# EAGLE design piezo-layer_v0.95-R004 (EAGLE 6.5.0)
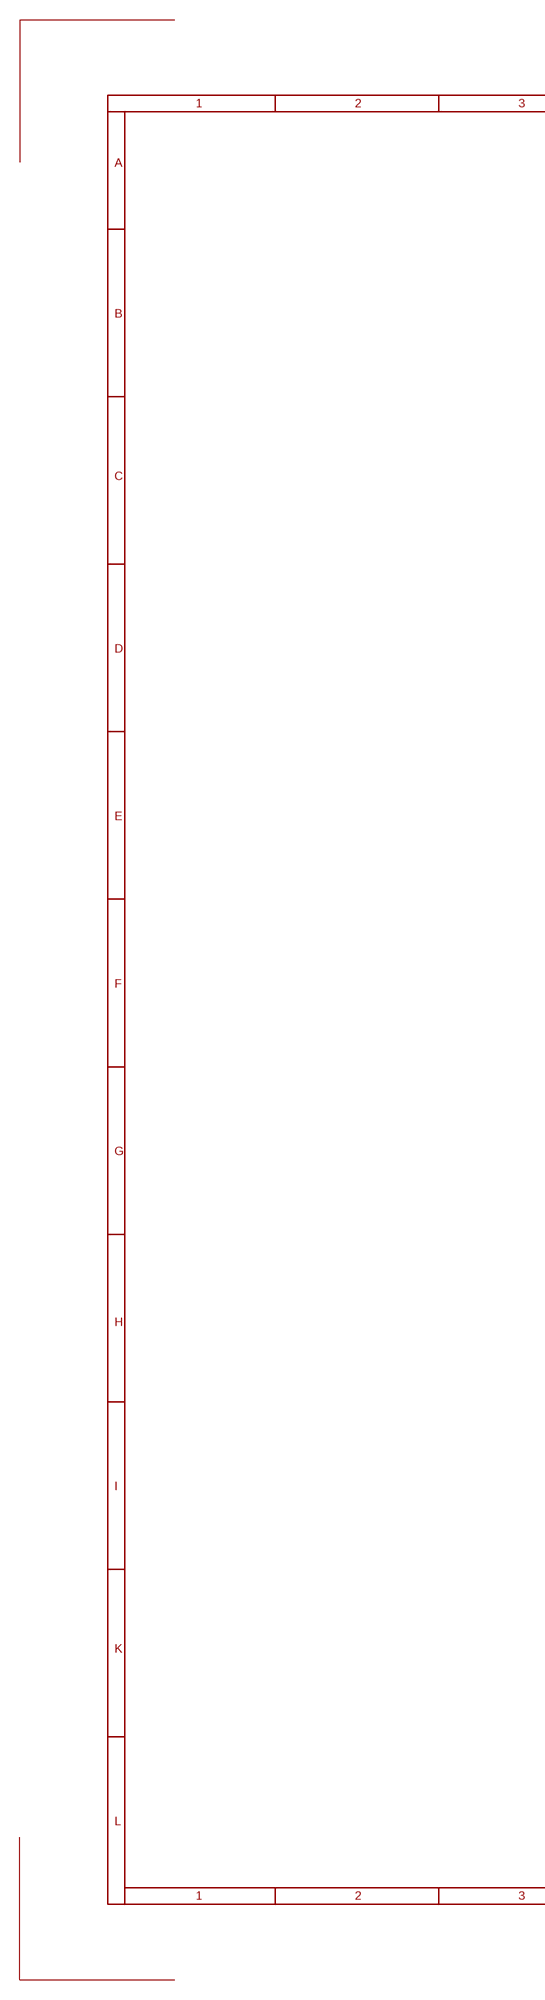
[diagram p0: schematic, sheet 1, part 1 of 2]
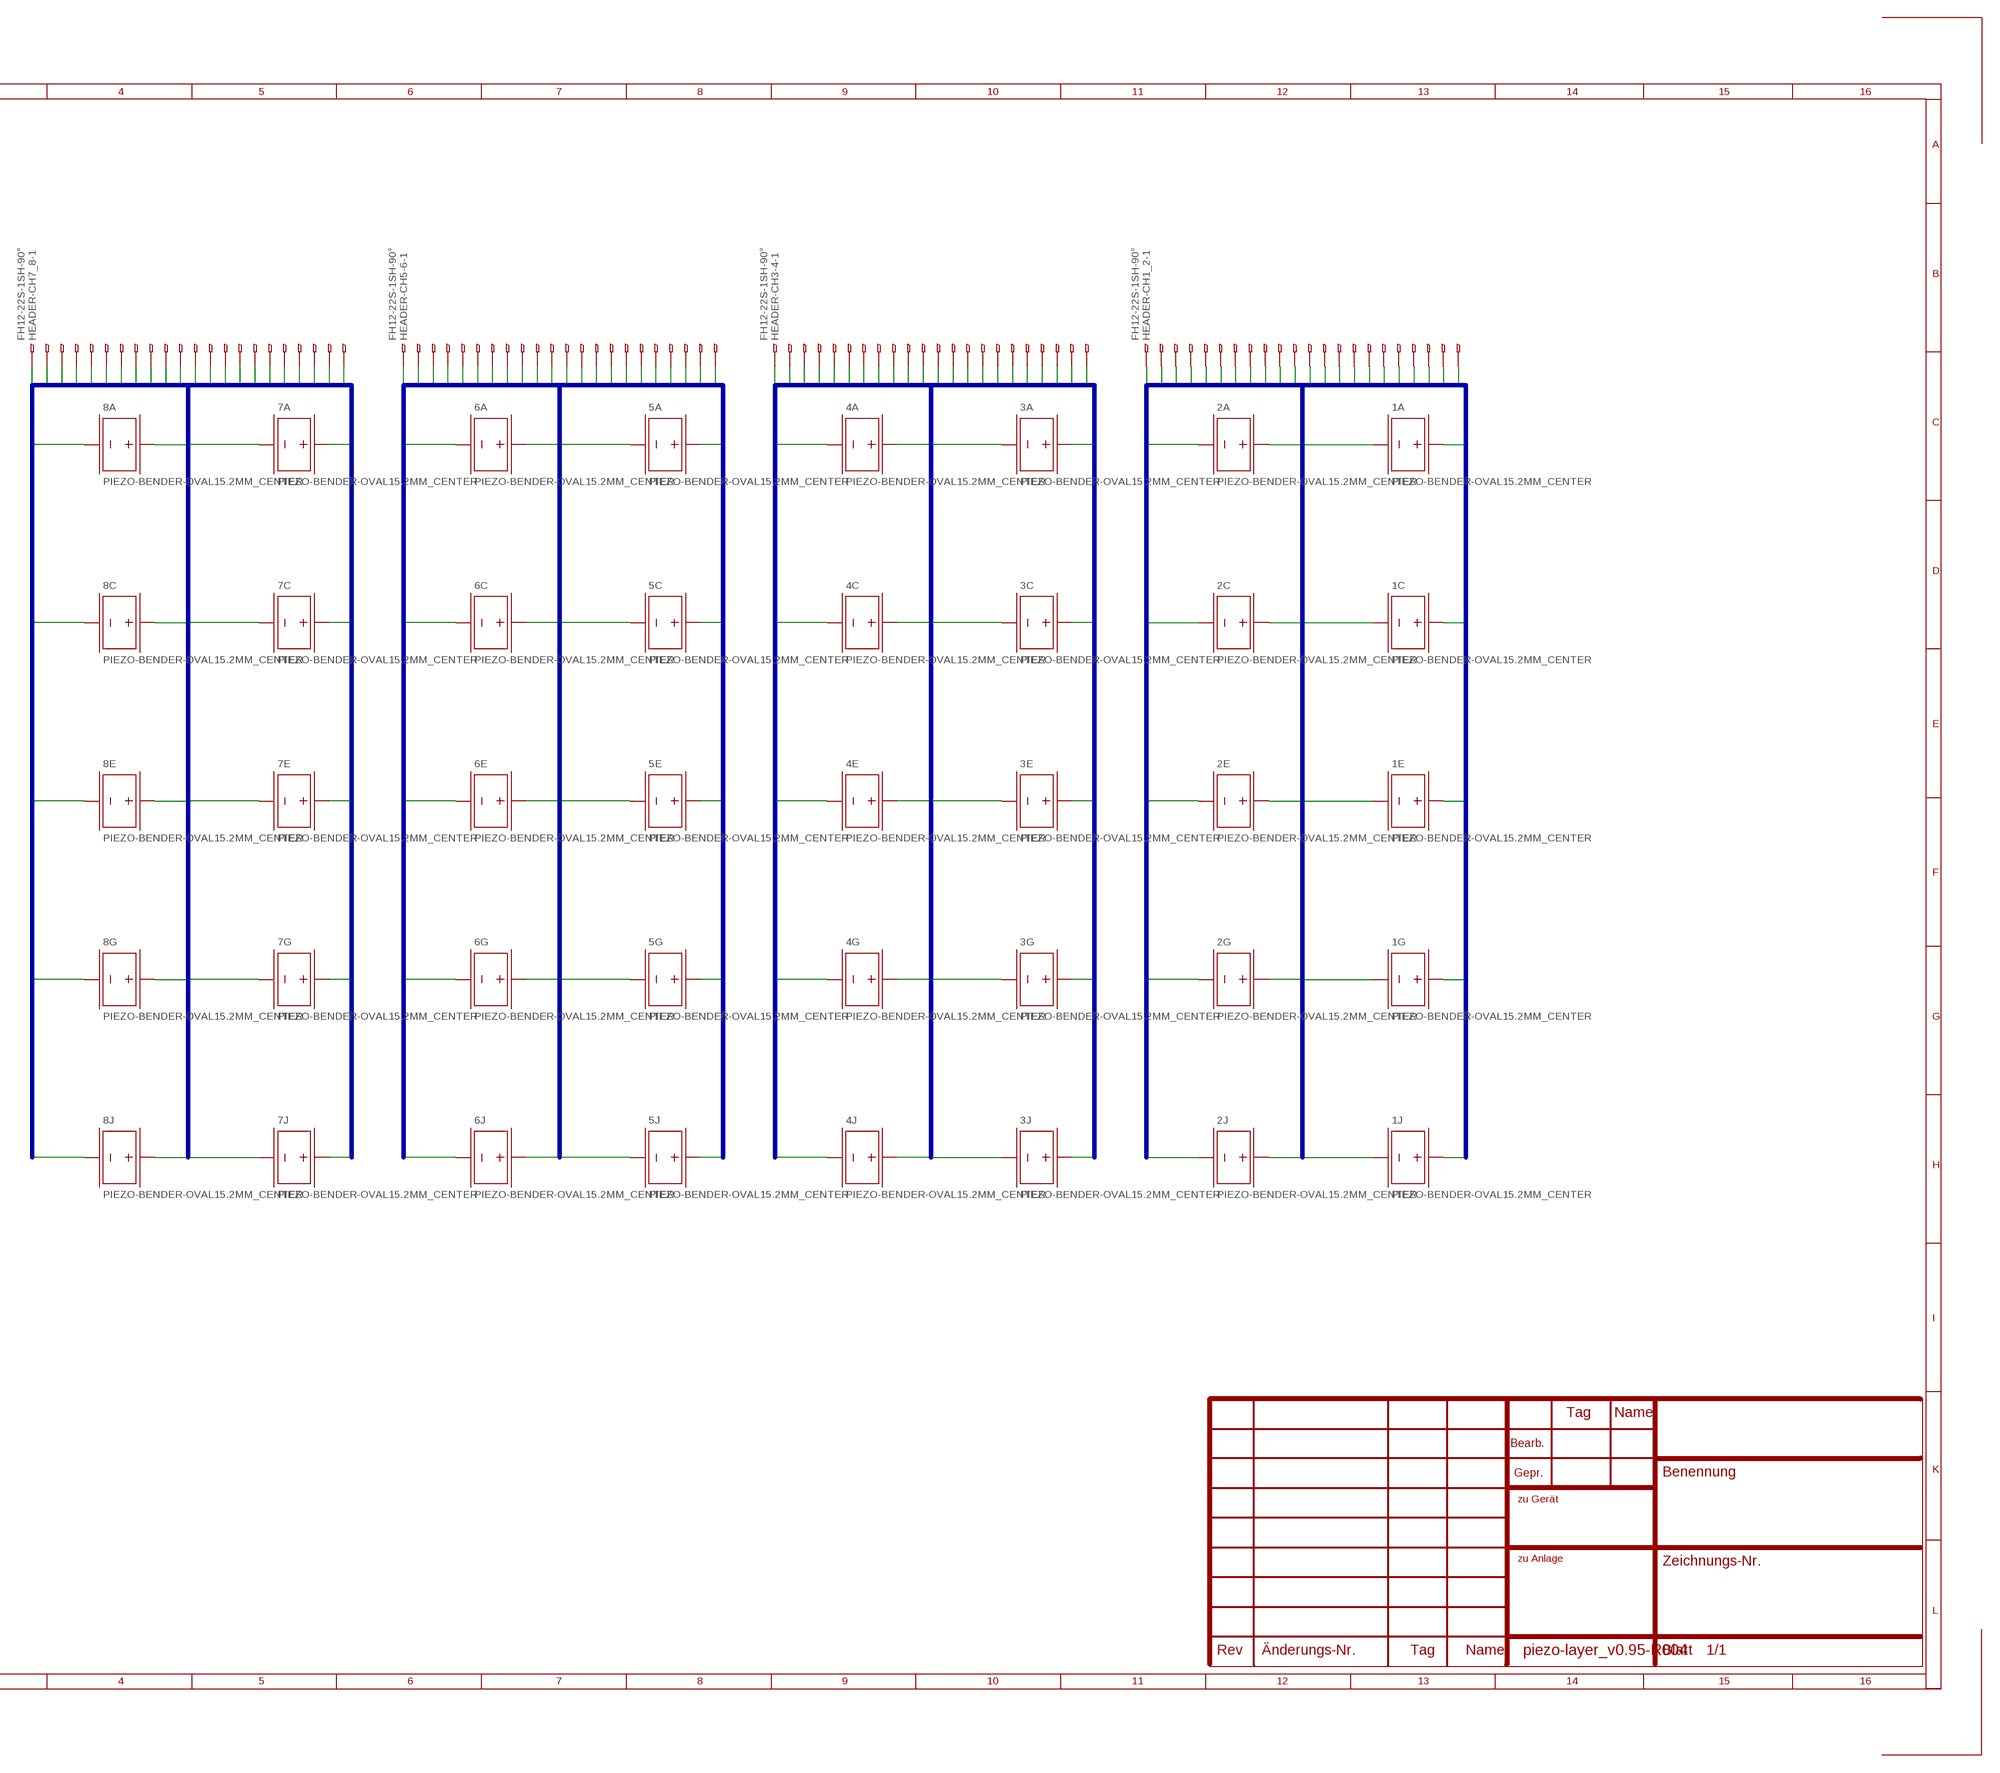
[diagram p1: schematic, sheet 1, part 2 of 2]

## Parts
1A  PIEZO-BENDER-OVAL15.2MM_CENTER  [PIEZO-BENDER-OVAL_15.2MM_BIGPADS_CENTER]
1C  PIEZO-BENDER-OVAL15.2MM_CENTER  [PIEZO-BENDER-OVAL_15.2MM_BIGPADS_CENTER]
1E  PIEZO-BENDER-OVAL15.2MM_CENTER  [PIEZO-BENDER-OVAL_15.2MM_BIGPADS_CENTER]
1G  PIEZO-BENDER-OVAL15.2MM_CENTER  [PIEZO-BENDER-OVAL_15.2MM_BIGPADS_CENTER]
1J  PIEZO-BENDER-OVAL15.2MM_CENTER  [PIEZO-BENDER-OVAL_15.2MM_BIGPADS_CENTER]
2A  PIEZO-BENDER-OVAL15.2MM_CENTER  [PIEZO-BENDER-OVAL_15.2MM_BIGPADS_CENTER]
2C  PIEZO-BENDER-OVAL15.2MM_CENTER  [PIEZO-BENDER-OVAL_15.2MM_BIGPADS_CENTER]
2E  PIEZO-BENDER-OVAL15.2MM_CENTER  [PIEZO-BENDER-OVAL_15.2MM_BIGPADS_CENTER]
2G  PIEZO-BENDER-OVAL15.2MM_CENTER  [PIEZO-BENDER-OVAL_15.2MM_BIGPADS_CENTER]
2J  PIEZO-BENDER-OVAL15.2MM_CENTER  [PIEZO-BENDER-OVAL_15.2MM_BIGPADS_CENTER]
3A  PIEZO-BENDER-OVAL15.2MM_CENTER  [PIEZO-BENDER-OVAL_15.2MM_BIGPADS_CENTER]
3C  PIEZO-BENDER-OVAL15.2MM_CENTER  [PIEZO-BENDER-OVAL_15.2MM_BIGPADS_CENTER]
3E  PIEZO-BENDER-OVAL15.2MM_CENTER  [PIEZO-BENDER-OVAL_15.2MM_BIGPADS_CENTER]
3G  PIEZO-BENDER-OVAL15.2MM_CENTER  [PIEZO-BENDER-OVAL_15.2MM_BIGPADS_CENTER]
3J  PIEZO-BENDER-OVAL15.2MM_CENTER  [PIEZO-BENDER-OVAL_15.2MM_BIGPADS_CENTER]
4A  PIEZO-BENDER-OVAL15.2MM_CENTER  [PIEZO-BENDER-OVAL_15.2MM_BIGPADS_CENTER]
4C  PIEZO-BENDER-OVAL15.2MM_CENTER  [PIEZO-BENDER-OVAL_15.2MM_BIGPADS_CENTER]
4E  PIEZO-BENDER-OVAL15.2MM_CENTER  [PIEZO-BENDER-OVAL_15.2MM_BIGPADS_CENTER]
4G  PIEZO-BENDER-OVAL15.2MM_CENTER  [PIEZO-BENDER-OVAL_15.2MM_BIGPADS_CENTER]
4J  PIEZO-BENDER-OVAL15.2MM_CENTER  [PIEZO-BENDER-OVAL_15.2MM_BIGPADS_CENTER]
5A  PIEZO-BENDER-OVAL15.2MM_CENTER  [PIEZO-BENDER-OVAL_15.2MM_BIGPADS_CENTER]
5C  PIEZO-BENDER-OVAL15.2MM_CENTER  [PIEZO-BENDER-OVAL_15.2MM_BIGPADS_CENTER]
5E  PIEZO-BENDER-OVAL15.2MM_CENTER  [PIEZO-BENDER-OVAL_15.2MM_BIGPADS_CENTER]
5G  PIEZO-BENDER-OVAL15.2MM_CENTER  [PIEZO-BENDER-OVAL_15.2MM_BIGPADS_CENTER]
5J  PIEZO-BENDER-OVAL15.2MM_CENTER  [PIEZO-BENDER-OVAL_15.2MM_BIGPADS_CENTER]
6A  PIEZO-BENDER-OVAL15.2MM_CENTER  [PIEZO-BENDER-OVAL_15.2MM_BIGPADS_CENTER]
6C  PIEZO-BENDER-OVAL15.2MM_CENTER  [PIEZO-BENDER-OVAL_15.2MM_BIGPADS_CENTER]
6E  PIEZO-BENDER-OVAL15.2MM_CENTER  [PIEZO-BENDER-OVAL_15.2MM_BIGPADS_CENTER]
6G  PIEZO-BENDER-OVAL15.2MM_CENTER  [PIEZO-BENDER-OVAL_15.2MM_BIGPADS_CENTER]
6J  PIEZO-BENDER-OVAL15.2MM_CENTER  [PIEZO-BENDER-OVAL_15.2MM_BIGPADS_CENTER]
7A  PIEZO-BENDER-OVAL15.2MM_CENTER  [PIEZO-BENDER-OVAL_15.2MM_BIGPADS_CENTER]
7C  PIEZO-BENDER-OVAL15.2MM_CENTER  [PIEZO-BENDER-OVAL_15.2MM_BIGPADS_CENTER]
7E  PIEZO-BENDER-OVAL15.2MM_CENTER  [PIEZO-BENDER-OVAL_15.2MM_BIGPADS_CENTER]
7G  PIEZO-BENDER-OVAL15.2MM_CENTER  [PIEZO-BENDER-OVAL_15.2MM_BIGPADS_CENTER]
7J  PIEZO-BENDER-OVAL15.2MM_CENTER  [PIEZO-BENDER-OVAL_15.2MM_BIGPADS_CENTER]
8A  PIEZO-BENDER-OVAL15.2MM_CENTER  [PIEZO-BENDER-OVAL_15.2MM_BIGPADS_CENTER]
8C  PIEZO-BENDER-OVAL15.2MM_CENTER  [PIEZO-BENDER-OVAL_15.2MM_BIGPADS_CENTER]
8E  PIEZO-BENDER-OVAL15.2MM_CENTER  [PIEZO-BENDER-OVAL_15.2MM_BIGPADS_CENTER]
8G  PIEZO-BENDER-OVAL15.2MM_CENTER  [PIEZO-BENDER-OVAL_15.2MM_BIGPADS_CENTER]
8J  PIEZO-BENDER-OVAL15.2MM_CENTER  [PIEZO-BENDER-OVAL_15.2MM_BIGPADS_CENTER]
HEADER-CH1_2  FH12-22S-1SH-90°  [FH12-22S-1SH]
HEADER-CH3-4  FH12-22S-1SH-90°  [FH12-22S-1SH]
HEADER-CH5-6  FH12-22S-1SH-90°  [FH12-22S-1SH]
HEADER-CH7_8  FH12-22S-1SH-90°  [FH12-22S-1SH]

## Nets
BUS1: 1J.TOP(+_1) HEADER-CH1_2.22
BUS2: HEADER-CH1_2.21
BUS3: 1G.TOP(+_1) HEADER-CH1_2.20
BUS4: HEADER-CH1_2.19
BUS5: 1A.BOTTOM(-_1) 1C.BOTTOM(-_1) 1E.BOTTOM(-_1) 1G.BOTTOM(-_1) 1J.BOTTOM(-_1) HEADER-CH1_2.12 HEADER-CH1_2.18
BUS6: 1E.TOP(+_1) HEADER-CH1_2.17
BUS7: HEADER-CH1_2.16
BUS8: 1C.TOP(+_1) HEADER-CH1_2.15
BUS9: HEADER-CH1_2.14
BUS10: 1A.TOP(+_1) HEADER-CH1_2.13
BUS11: 2J.TOP(+_1) HEADER-CH1_2.11
BUS12: HEADER-CH1_2.10
BUS13: 2G.TOP(+_1) HEADER-CH1_2.9
BUS14: HEADER-CH1_2.8
BUS15: 2A.BOTTOM(-_1) 2C.BOTTOM(-_1) 2E.BOTTOM(-_1) 2G.BOTTOM(-_1) 2J.BOTTOM(-_1) HEADER-CH1_2.1 HEADER-CH1_2.7
BUS16: 2E.TOP(+_1) HEADER-CH1_2.6
BUS17: HEADER-CH1_2.5
BUS18: 2C.TOP(+_1) HEADER-CH1_2.4
BUS19: HEADER-CH1_2.3
BUS20: 2A.TOP(+_1) HEADER-CH1_2.2
BUS21: 3J.TOP(+_1) HEADER-CH3-4.22
BUS22: HEADER-CH3-4.21
BUS23: 3G.TOP(+_1) HEADER-CH3-4.20
BUS24: HEADER-CH3-4.19
BUS25: 3A.BOTTOM(-_1) 3C.BOTTOM(-_1) 3E.BOTTOM(-_1) 3G.BOTTOM(-_1) 3J.BOTTOM(-_1) HEADER-CH3-4.12 HEADER-CH3-4.18
BUS26: 3E.TOP(+_1) HEADER-CH3-4.17
BUS27: HEADER-CH3-4.16
BUS28: 3C.TOP(+_1) HEADER-CH3-4.15
BUS29: HEADER-CH3-4.14
BUS30: 3A.TOP(+_1) HEADER-CH3-4.13
BUS31: 4J.TOP(+_1) HEADER-CH3-4.11
BUS32: HEADER-CH3-4.10
BUS33: 4G.TOP(+_1) HEADER-CH3-4.9
BUS34: HEADER-CH3-4.8
BUS35: 4A.BOTTOM(-_1) 4C.BOTTOM(-_1) 4E.BOTTOM(-_1) 4G.BOTTOM(-_1) 4J.BOTTOM(-_1) HEADER-CH3-4.1 HEADER-CH3-4.7
BUS36: 4E.TOP(+_1) HEADER-CH3-4.6
BUS37: HEADER-CH3-4.5
BUS38: 4C.TOP(+_1) HEADER-CH3-4.4
BUS39: HEADER-CH3-4.3
BUS40: 4A.TOP(+_1) HEADER-CH3-4.2
BUS41: 5J.TOP(+_1) HEADER-CH5-6.22
BUS42: HEADER-CH5-6.21
BUS43: 5G.TOP(+_1) HEADER-CH5-6.20
BUS44: HEADER-CH5-6.19
BUS45: 5A.BOTTOM(-_1) 5C.BOTTOM(-_1) 5E.BOTTOM(-_1) 5G.BOTTOM(-_1) 5J.BOTTOM(-_1) HEADER-CH5-6.12 HEADER-CH5-6.18
BUS46: 5E.TOP(+_1) HEADER-CH5-6.17
BUS47: HEADER-CH5-6.16
BUS48: 5C.TOP(+_1) HEADER-CH5-6.15
BUS49: HEADER-CH5-6.14
BUS50: 5A.TOP(+_1) HEADER-CH5-6.13
BUS51: 6J.TOP(+_1) HEADER-CH5-6.11
BUS52: HEADER-CH5-6.10
BUS53: 6G.TOP(+_1) HEADER-CH5-6.9
BUS54: HEADER-CH5-6.8
BUS55: 6A.BOTTOM(-_1) 6C.BOTTOM(-_1) 6E.BOTTOM(-_1) 6G.BOTTOM(-_1) 6J.BOTTOM(-_1) HEADER-CH5-6.1 HEADER-CH5-6.7
BUS56: 6E.TOP(+_1) HEADER-CH5-6.6
BUS57: HEADER-CH5-6.5
BUS58: 6C.TOP(+_1) HEADER-CH5-6.4
BUS59: HEADER-CH5-6.3
BUS60: 6A.TOP(+_1) HEADER-CH5-6.2
BUS61: 7J.TOP(+_1) HEADER-CH7_8.22
BUS62: HEADER-CH7_8.21
BUS63: 7G.TOP(+_1) HEADER-CH7_8.20
BUS64: HEADER-CH7_8.19
BUS65: 7A.BOTTOM(-_1) 7C.BOTTOM(-_1) 7E.BOTTOM(-_1) 7G.BOTTOM(-_1) 7J.BOTTOM(-_1) HEADER-CH7_8.12 HEADER-CH7_8.18
BUS66: 7E.TOP(+_1) HEADER-CH7_8.17
BUS67: HEADER-CH7_8.16
BUS68: 7C.TOP(+_1) HEADER-CH7_8.15
BUS69: HEADER-CH7_8.14
BUS70: 7A.TOP(+_1) HEADER-CH7_8.13
BUS71: 8J.TOP(+_1) HEADER-CH7_8.11
BUS72: HEADER-CH7_8.10
BUS73: 8G.TOP(+_1) HEADER-CH7_8.9
BUS74: HEADER-CH7_8.8
BUS75: 8A.BOTTOM(-_1) 8C.BOTTOM(-_1) 8E.BOTTOM(-_1) 8G.BOTTOM(-_1) 8J.BOTTOM(-_1) HEADER-CH7_8.1 HEADER-CH7_8.7
BUS76: 8E.TOP(+_1) HEADER-CH7_8.6
BUS77: HEADER-CH7_8.5
BUS78: 8C.TOP(+_1) HEADER-CH7_8.4
BUS79: HEADER-CH7_8.3
BUS80: 8A.TOP(+_1) HEADER-CH7_8.2

## Buses
BUS[1..20]
BUS[21..40]
BUS[41..60]
BUS[61..80]

## Library data of the parts
1A 1C 1E 1G 1J 2A 2C 2E 2G 2J 3A 3C 3E 3G 3J 4A 4C 4E 4G 4J 5A 5C 5E 5G 5J 6A 6C 6E 6G 6J 7A 7C 7E 7G 7J 8A 8C 8E 8G 8J = ICST:PIEZO-BENDER-OVAL
HEADER-CH1_2 HEADER-CH3-4 HEADER-CH5-6 HEADER-CH7_8 = ICST:FH12-22S-1SH

## Board
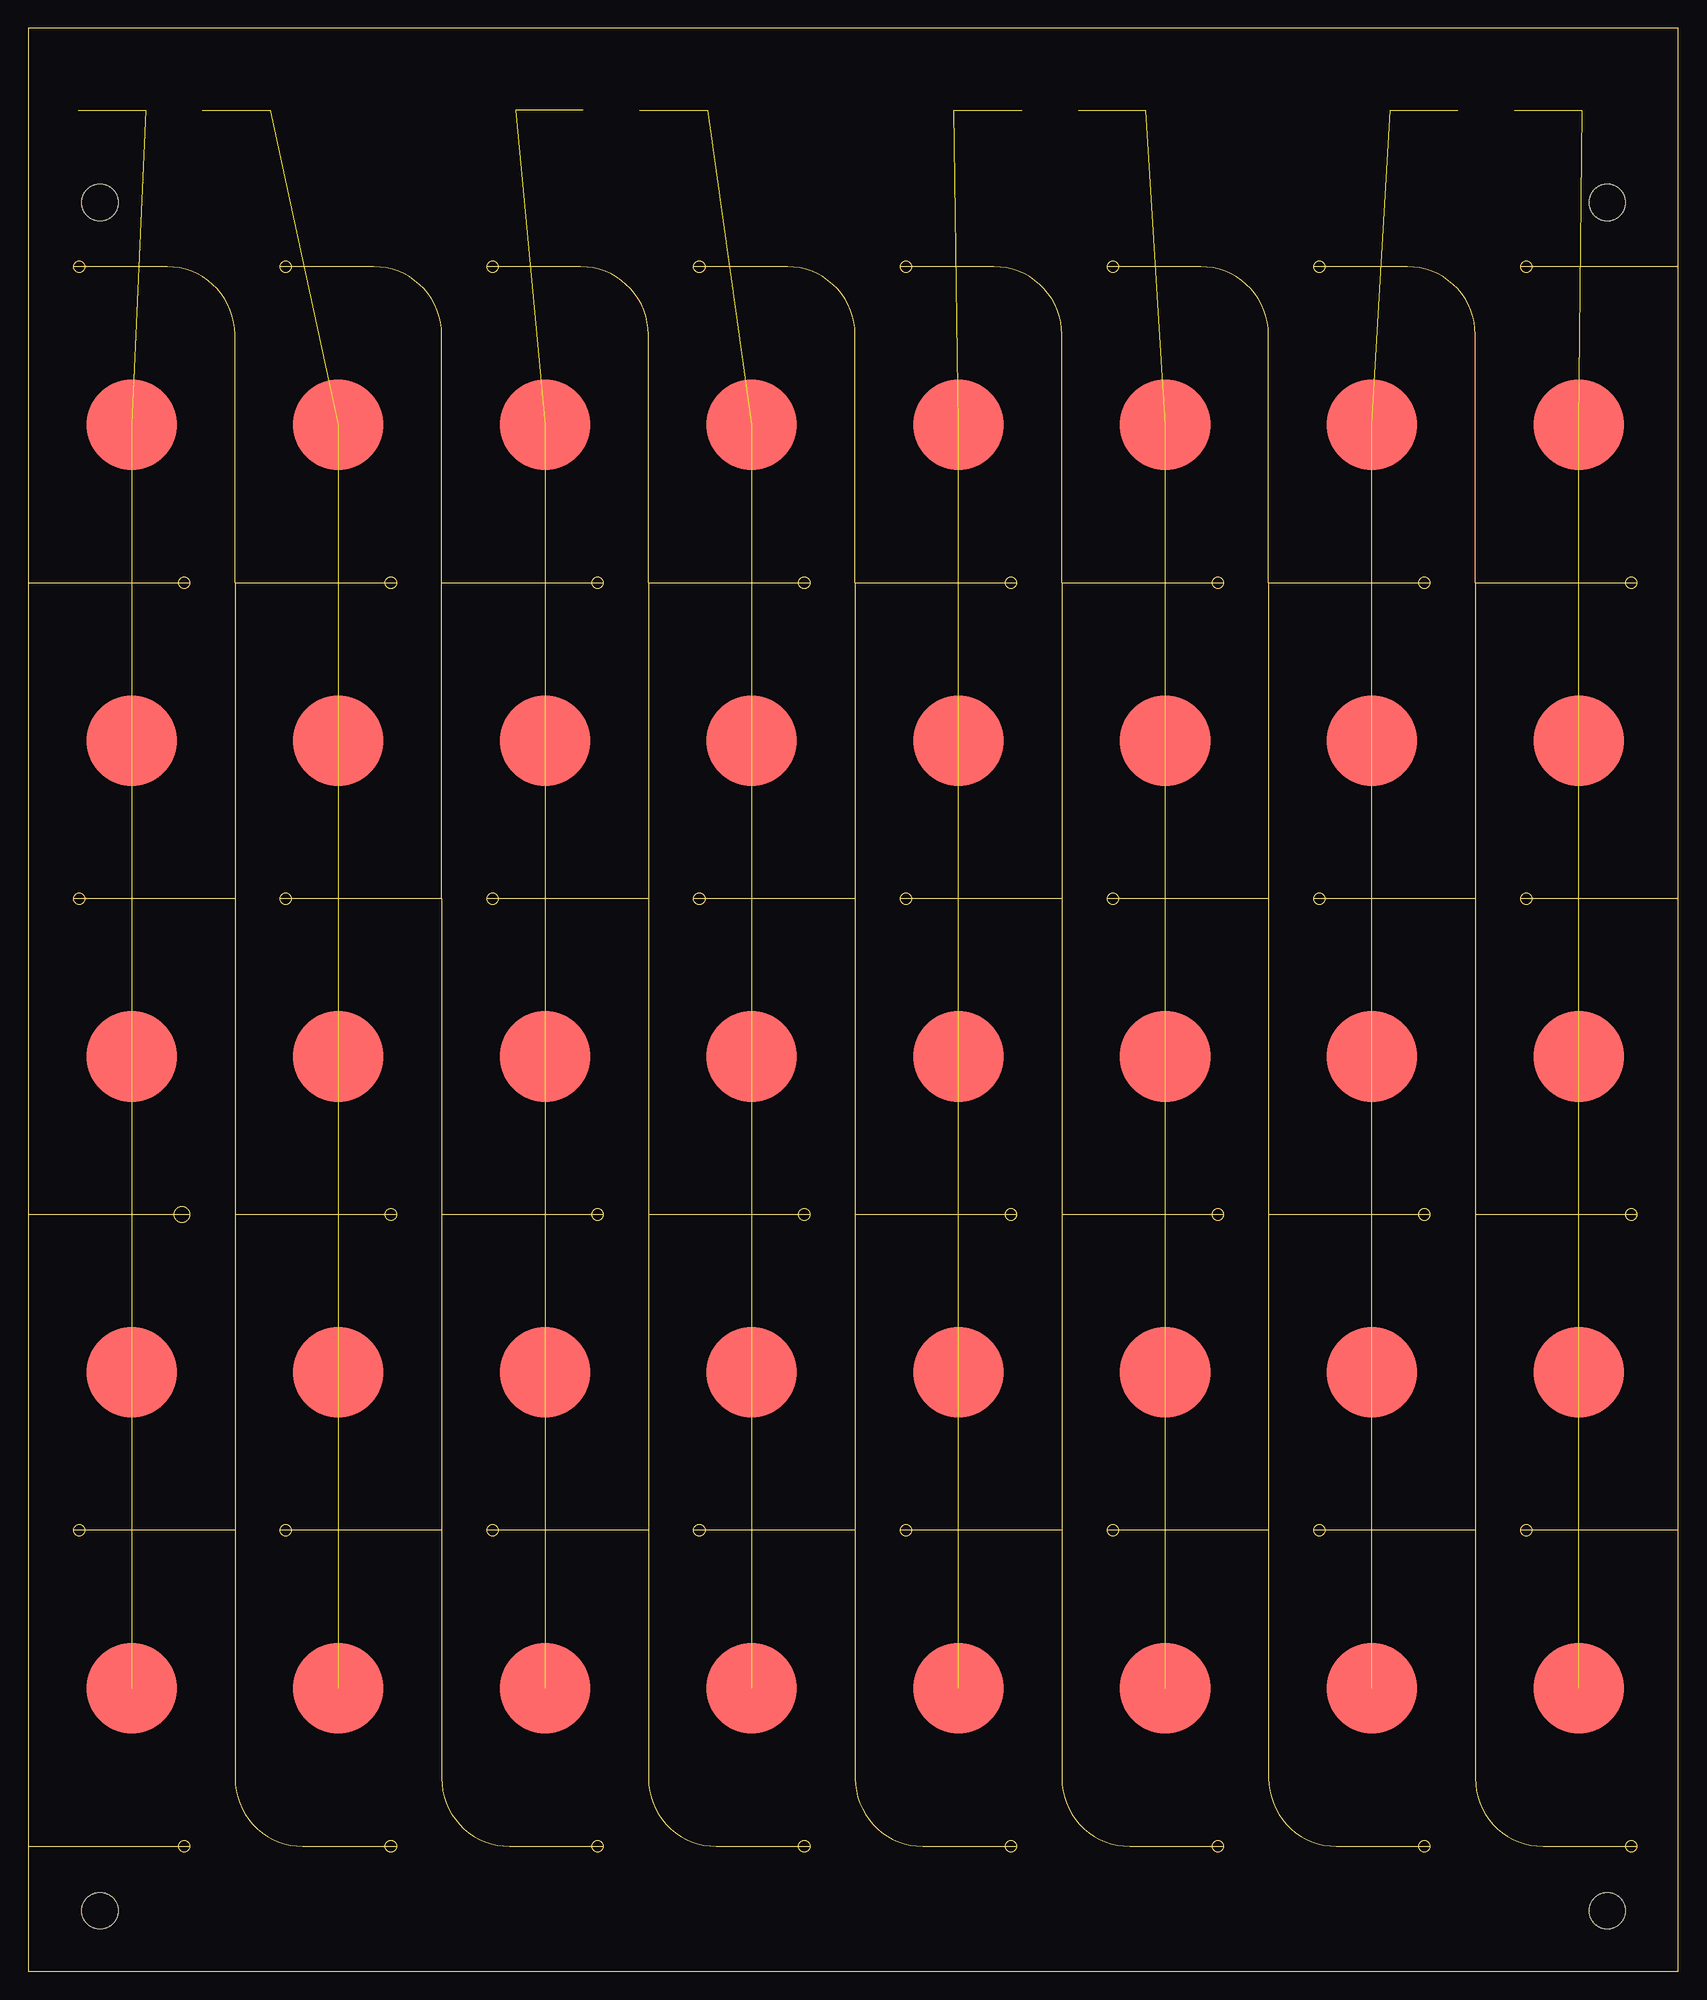
[diagram p2: board, top side]
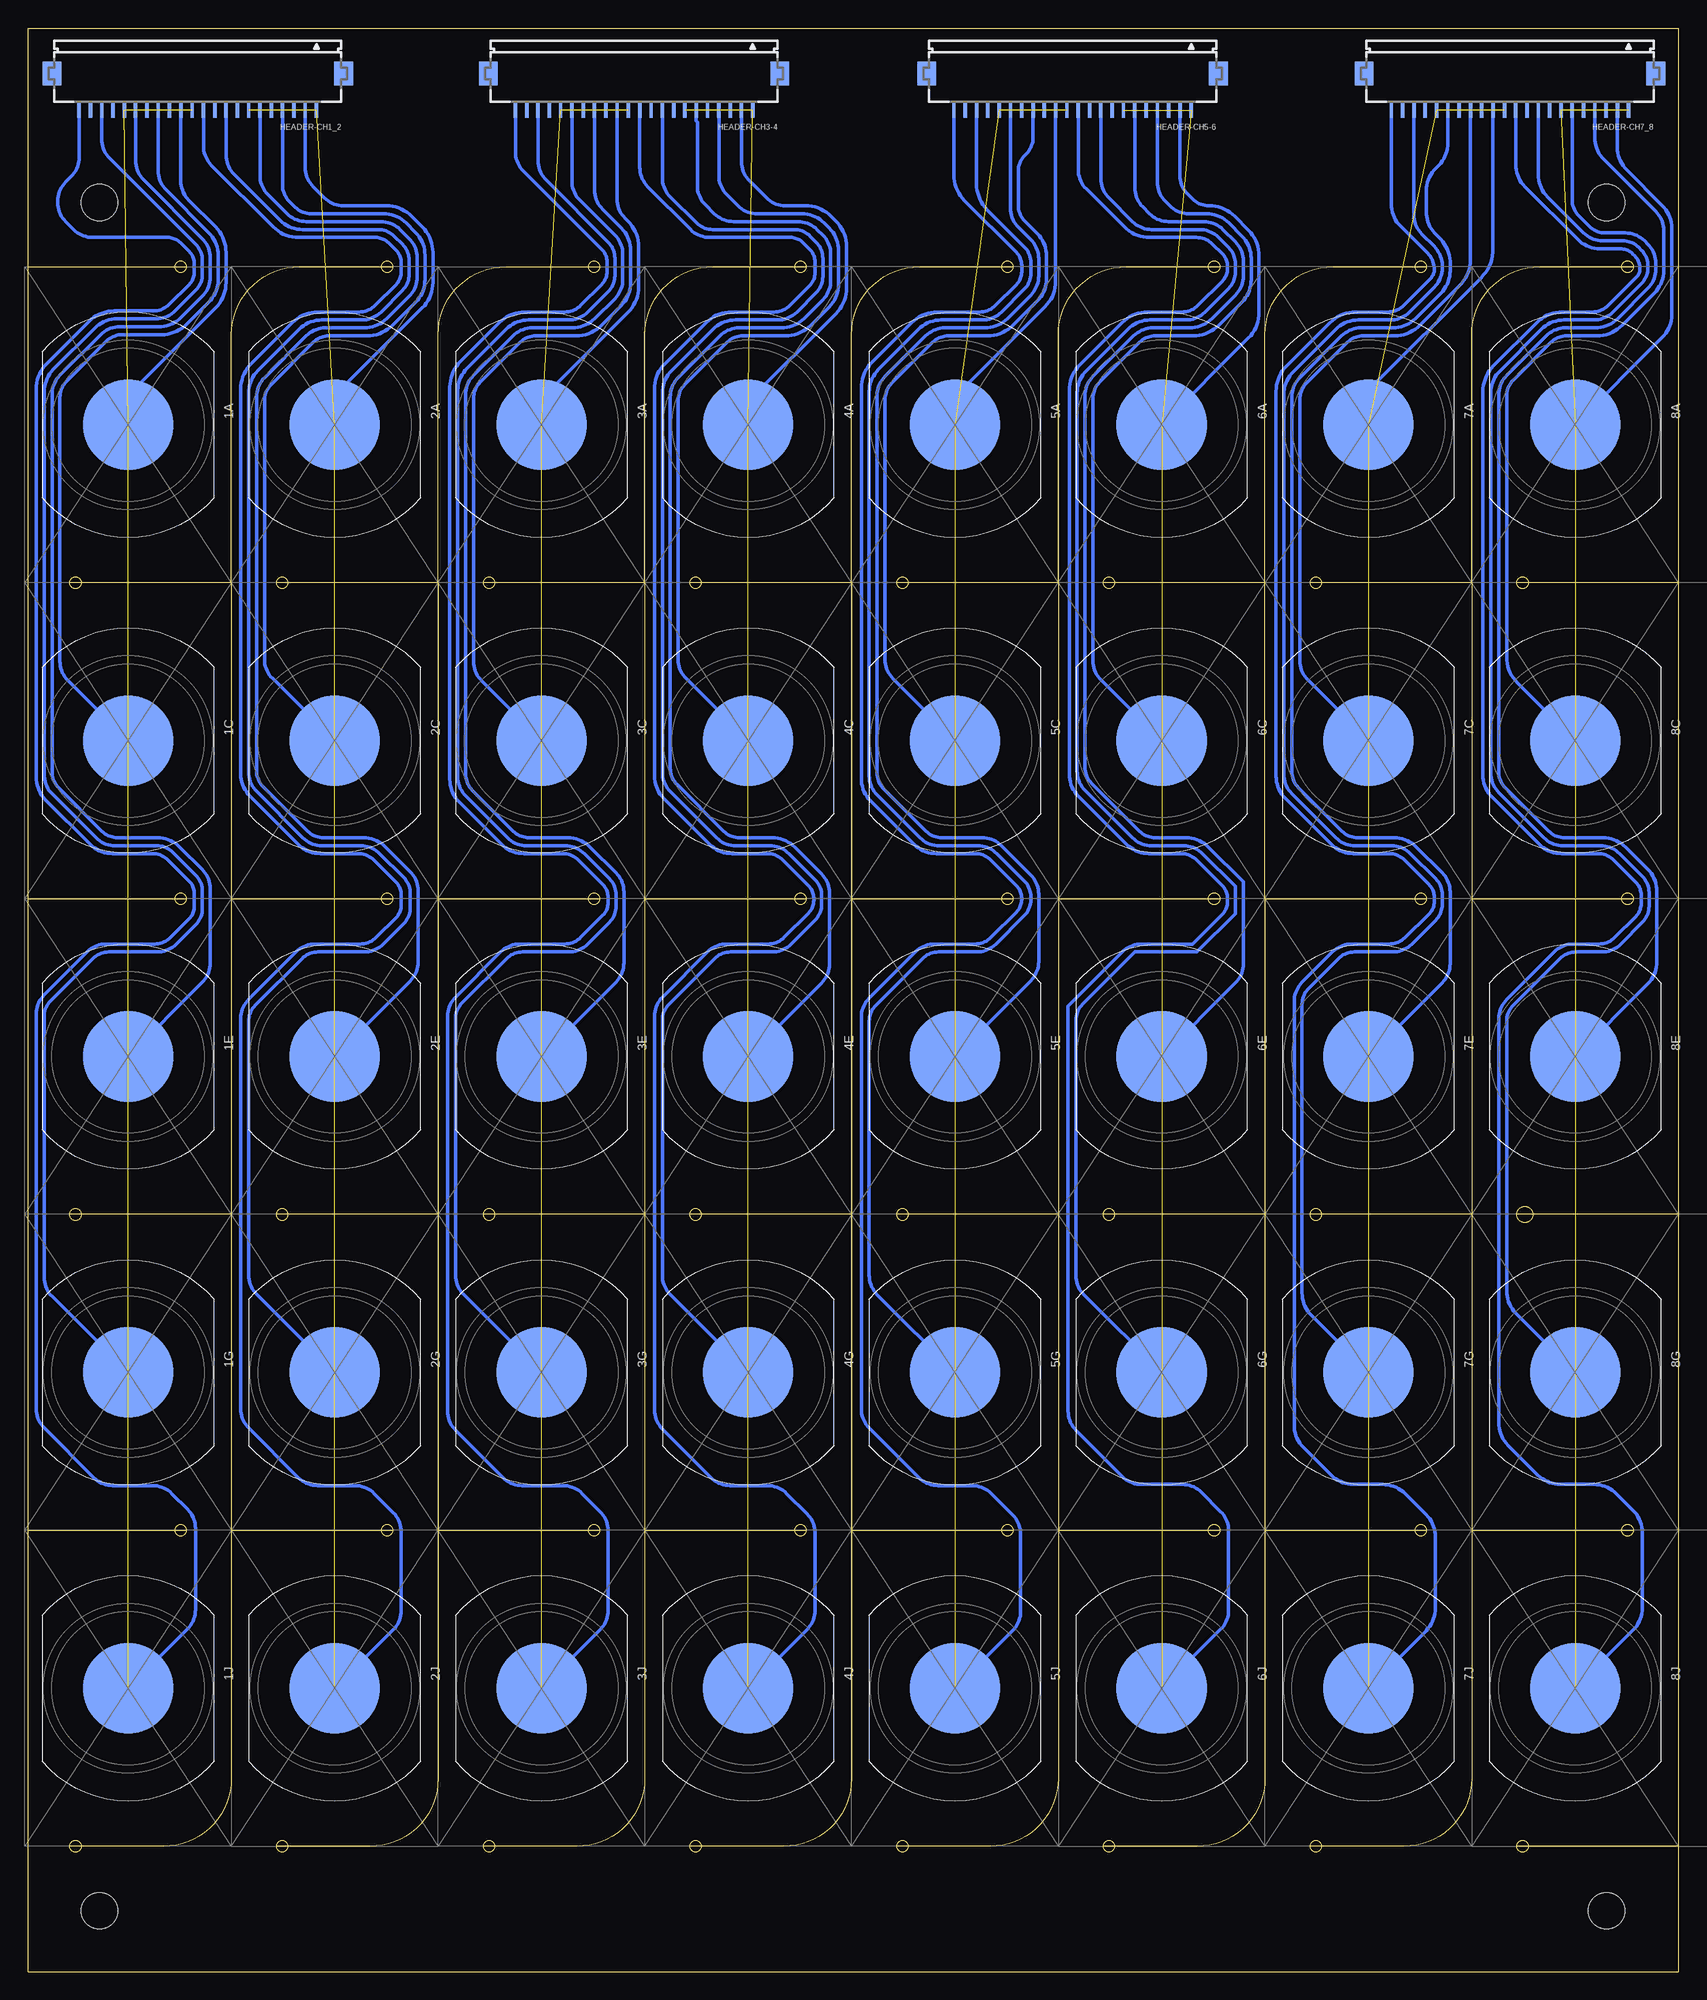
[diagram p3: board, bottom side, seen from below]

Size 146 x 171.9 mm. Coordinates in mm from the lower left corner, seen from the top.
Outline: 0,122.86 0,171.9 146,171.9 146,150.8
Outline: 0,122.86 0,66.98
Outline: 0,66.98 0,11.1
Outline: 0,11.1 0,0 146,0 146,39.04
Outline: 146,39.04 146,94.92
Outline: 146,94.92 146,150.8
Outline: 18.29,122.86 18.29,144.8 arc90 12.29,150.8 4,150.8
Outline: 18.29,39.04 18.29,17.1 arc90 24.29,11.1 32.58,11.1
Outline: 0,122.86 14.29,122.86
Outline: 0,66.98 14.29,66.98
Outline: 0,11.1 14.29,11.1
Outline: 18.29,39.04 4,39.04
Outline: 18.29,94.92 4,94.92
Outline: 36.58,94.92 36.58,122.86
Outline: 36.58,122.86 36.58,144.8 arc90 30.58,150.8 22.29,150.8
Outline: 36.58,94.92 36.58,66.98
Outline: 36.58,66.98 36.58,39.04
Outline: 36.58,39.04 36.58,17.1 arc90 42.58,11.1 50.87,11.1
Outline: 18.29,122.86 18.29,94.92
Outline: 18.29,94.92 18.29,66.98
Outline: 18.29,66.98 18.29,39.04
Outline: 18.29,122.86 32.58,122.86
Outline: 18.29,66.98 32.58,66.98
Outline: 36.58,39.04 22.29,39.04
Outline: 36.58,94.92 22.29,94.92
Outline: 54.87,122.86 54.87,144.8 arc90 48.87,150.8 40.58,150.8
Outline: 54.87,122.86 54.87,94.92
Outline: 54.87,94.92 54.87,66.98
Outline: 54.87,66.98 54.87,39.04
Outline: 54.87,39.04 54.87,17.1 arc90 60.87,11.1 69.16,11.1
Outline: 36.58,122.86 50.87,122.86
Outline: 36.58,66.98 50.87,66.98
Outline: 54.87,39.04 40.58,39.04
Outline: 54.87,94.92 40.58,94.92
Outline: 73.16,122.86 73.16,144.8 arc90 67.16,150.8 58.87,150.8
Outline: 73.16,122.86 73.16,94.92
Outline: 73.16,94.92 73.16,66.98
Outline: 73.16,66.98 73.16,39.04
Outline: 73.16,39.04 73.16,17.1 arc90 79.16,11.1 87.45,11.1
Outline: 54.87,122.86 69.16,122.86
Outline: 54.87,66.98 69.16,66.98
Outline: 73.16,39.04 58.87,39.04
Outline: 73.16,94.92 58.87,94.92
Outline: 91.45,122.86 91.45,144.8 arc90 85.45,150.8 77.16,150.8
Outline: 91.45,122.86 91.45,94.92
Outline: 91.45,94.92 91.45,66.98
Outline: 91.45,66.98 91.45,39.04
Outline: 91.45,39.04 91.45,17.1 arc90 97.45,11.1 105.74,11.1
Outline: 73.16,122.86 87.45,122.86
Outline: 73.16,66.98 87.45,66.98
Outline: 91.45,39.04 77.16,39.04
Outline: 91.45,94.92 77.16,94.92
Outline: 109.74,122.86 109.74,144.8 arc90 103.74,150.8 95.45,150.8
Outline: 109.74,122.86 109.74,94.92
Outline: 109.74,94.92 109.74,66.98
Outline: 109.74,66.98 109.74,39.04
Outline: 109.74,39.04 109.74,17.1 arc90 115.74,11.1 124.03,11.1
Outline: 91.45,122.86 105.74,122.86
Outline: 91.45,66.98 105.74,66.98
Outline: 109.74,39.04 95.45,39.04
Outline: 109.74,94.92 95.45,94.92
Outline: 128.03,122.86 128.03,144.8 arc90 122.03,150.8 113.74,150.8
Outline: 128.03,122.86 128.03,94.92
Outline: 128.03,94.92 128.03,66.98
Outline: 128.03,66.98 128.03,39.04
Outline: 128.03,39.04 128.03,17.1 arc90 134.03,11.1 142.32,11.1
Outline: 109.74,122.86 124.03,122.86
Outline: 109.74,66.98 124.03,66.98
Outline: 128.03,39.04 113.74,39.04
Outline: 128.03,94.92 113.74,94.92
Outline: 146,150.8 132.03,150.8
Outline: 128.03,122.86 142.32,122.86
Outline: 128.03,66.98 142.32,66.98
Outline: 146,39.04 132.03,39.04
Outline: 146,94.92 132.03,94.92
Outline: circle at 4.5,150.8 radius 0.5
Outline: circle at 13.79,122.86 radius 0.5
Outline: circle at 4.5,94.92 radius 0.5
Outline: circle at 13.59,66.98 radius 0.7
Outline: circle at 4.5,39.04 radius 0.5
Outline: circle at 13.79,11.1 radius 0.5
Outline: circle at 22.79,150.8 radius 0.5
Outline: circle at 32.08,122.86 radius 0.5
Outline: circle at 22.79,94.92 radius 0.5
Outline: circle at 32.08,66.98 radius 0.5
Outline: circle at 22.79,39.04 radius 0.5
Outline: circle at 32.08,11.1 radius 0.5
Outline: circle at 41.08,150.8 radius 0.5
Outline: circle at 59.37,150.8 radius 0.5
Outline: circle at 77.66,150.8 radius 0.5
Outline: circle at 95.95,150.8 radius 0.5
Outline: circle at 114.24,150.8 radius 0.5
Outline: circle at 132.53,150.8 radius 0.5
Outline: circle at 50.37,122.86 radius 0.5
Outline: circle at 68.66,122.86 radius 0.5
Copper layers 1*16: Top 0.012mm / dielectric 0.025mm / Bottom 0.012mm
Design rules "1L-0.025-0.15_0.3mm *": minimum track width 0.2mm, minimum drill 0.3mm, track to track 0.15mm, track to pad 0.15mm, pad to pad 0.15mm, via to via 0.15mm, smd to smd 0.15mm, copper to edge 0.5mm, drill to drill 1mm, minimum pad ring 10mil, minimum via ring 8mil, stop-mask expansion 4mil, vias tented up to drill 0mil, thermal gap 10mil
Holes 3.2 mm at 6.35,156.5 139.7,156.5 6.35,5.4 139.7,5.4

### Footprints (pad centres in the part's own frame; a part is rotated, then mirrored left to right if it is on the bottom)
PIEZO-BENDER-OVAL_15.2MM_BIGPADS_CENTER = smd 8 x 8 bottom: BOTTOM 0,0 | smd 8 x 8: TOP 0,0
FH12-22S-1SH = smd 0.3 x 1.3: 1 -10.5,3.25; 2 -9.5,3.25; 3 -8.5,3.25; 4 -7.5,3.25; 5 -6.5,3.25; 6 -5.5,3.25; 7 -4.5,3.25; 8 -3.5,3.25; 9 -2.5,3.25; 10 -1.5,3.25; 11 -0.5,3.25; 12 0.5,3.25; 13 1.5,3.25; 14 2.5,3.25; 15 3.5,3.25; 16 4.5,3.25; 17 5.5,3.25; 18 6.5,3.25; 19 7.5,3.25; 20 8.5,3.25; 21 9.5,3.25; 22 10.5,3.25 | smd 1.65 x 2.05: PAD1 -12.9,0; PAD2 12.9,0

### Placement (x,y rotation side)
1A  137.17,136.83 270 bottom
1C  137.17,108.89 270 bottom
1E  137.17,80.95 270 bottom
1G  137.17,53.01 270 bottom
1J  137.17,25.07 270 bottom
2A  118.88,136.83 270 bottom
2C  118.88,108.89 270 bottom
2E  118.88,80.95 270 bottom
2G  118.88,53.01 270 bottom
2J  118.88,25.07 270 bottom
3A  100.59,136.83 270 bottom
3C  100.59,108.89 270 bottom
3E  100.59,80.95 270 bottom
3G  100.59,53.01 270 bottom
3J  100.59,25.07 270 bottom
4A  82.3,136.83 270 bottom
4C  82.3,108.89 270 bottom
4E  82.3,80.95 270 bottom
4G  82.3,53.01 270 bottom
4J  82.3,25.07 270 bottom
5A  64.01,136.83 270 bottom
5C  64.01,108.89 270 bottom
5E  64.01,80.95 270 bottom
5G  64.01,53.01 270 bottom
5J  64.01,25.07 270 bottom
6A  45.72,136.83 270 bottom
6C  45.72,108.89 270 bottom
6E  45.72,80.95 270 bottom
6G  45.72,53.01 270 bottom
6J  45.72,25.07 270 bottom
7A  27.43,136.83 270 bottom
7C  27.43,108.89 270 bottom
7E  27.43,80.95 270 bottom
7G  27.43,53.01 270 bottom
7J  27.43,25.07 270 bottom
8A  9.14,136.83 270 bottom
8C  9.14,108.89 270 bottom
8E  9.14,80.95 270 bottom
8G  9.14,53.01 270 bottom
8J  9.14,25.07 270 bottom
HEADER-CH1_2  131,167.9 180 bottom
HEADER-CH3-4  92.4,167.9 180 bottom
HEADER-CH5-6  53.6,167.9 180 bottom
HEADER-CH7_8  14.9,167.9 180 bottom

### Tracks (layer width: path | path; a pad name or v marks a point on that pad's centre or on a via)
BUS1
  Bottom 0.3: HEADER-CH1_2.22 141.5,160.49 arc45 142.2,158.8 142.7,158.3 arc-45 143.4,156.61 143.4,156.49 arc-45 142.7,154.8 142,154.1 arc-45 140.31,153.4 133.66,153.4 arc45 132.53,152.93 131.77,152.17 arc45 131.3,151.04 131.3,150.36 arc45 131.77,149.23 133.51,147.49 arc45 134.93,146.9 138.38,146.9 arc-45 140.64,145.96 144.36,142.24 arc-45 145.3,139.97 145.3,105.66 arc-45 144.48,103.68 140.52,99.72 arc-45 138.54,98.9 135.03,98.9 arc45 133.61,98.31 131.77,96.47 arc45 131.3,95.34 131.3,94.26 arc45 131.77,93.13 133.41,91.49 arc45 134.83,90.9 139.11,90.9 arc-45 140.8,90.2 144.6,86.4 arc-45 145.3,84.71 145.3,49.79 arc-45 144.6,48.1 140.2,43.7 arc-45 138.51,43 134.99,43 arc45 133.3,42.3 131.9,40.9 arc45 131.2,39.21 131.2,32.03 arc45 131.9,30.34 1J.TOP
BUS3
  Bottom 0.3: HEADER-CH1_2.20 139.5,162.09 arc-45 138.8,160.4 131.19,152.79 arc45 130.6,151.37 130.6,150.13 arc45 131.19,148.71 133,146.9 arc45 134.69,146.2 138.14,146.2 arc-45 140.12,145.38 143.78,141.72 arc-45 144.6,139.74 144.6,105.89 arc-45 143.9,104.2 140,100.3 arc-45 138.31,99.6 134.63,99.6 arc45 133.21,99.01 131.19,96.99 arc45 130.6,95.57 130.6,94.03 arc45 131.19,92.61 132.9,90.9 arc45 134.59,90.2 138.87,90.2 arc-45 140.29,89.61 144.01,85.89 arc-45 144.6,84.47 144.6,61.43 arc-45 143.9,59.74 1G.TOP
BUS5  (6 unrouted)
BUS6
  Bottom 0.3: HEADER-CH1_2.17 136.5,160.19 arc-45 135.8,158.5 130.6,153.3 arc45 129.9,151.61 129.9,149.89 arc45 130.6,148.2 132.48,146.32 arc45 134.46,145.5 137.91,145.5 arc-45 139.6,144.8 143.2,141.2 arc-45 143.9,139.51 143.9,106.13 arc-45 143.31,104.71 139.49,100.89 arc-45 138.07,100.3 134.56,100.3 arc45 132.58,99.48 130.6,97.5 arc45 129.9,95.81 129.9,89.21 arc45 130.6,87.52 1E.TOP
BUS8
  Bottom 0.3: HEADER-CH1_2.15 134.5,159.29 arc-45 133.8,157.6 130.02,153.82 arc45 129.2,151.84 129.2,149.66 arc45 130.02,147.68 131.96,145.74 arc45 134.22,144.8 137.67,144.8 arc-45 139.09,144.21 142.61,140.69 arc-45 143.2,139.27 143.2,115.91 arc-45 142.5,114.22 1C.TOP
BUS10
  Bottom 0.3: HEADER-CH1_2.13 132.5,158.39 arc-45 131.8,156.7 129.44,154.34 arc45 128.5,152.08 128.5,149.43 arc45 129.44,147.16 137.17,139.43 1A.TOP
BUS11
  Bottom 0.3: HEADER-CH1_2.11 130.5,161.49 arc-45 129.8,159.8 124.34,154.34 arc-45 122.08,153.4 115.26,153.4 arc45 114.13,152.93 113.47,152.27 arc45 113,151.14 113,150.36 arc45 113.47,149.23 115.31,147.39 arc45 116.73,146.8 120.38,146.8 arc-45 122.64,145.86 126.26,142.24 arc-45 127.2,139.97 127.2,105.96 arc-45 126.38,103.98 122.12,99.72 arc-45 120.14,98.9 116.83,98.9 arc45 115.41,98.31 113.47,96.37 arc45 113,95.24 113,94.36 arc45 113.47,93.23 115.21,91.49 arc45 116.63,90.9 120.61,90.9 arc-45 122.3,90.2 126.5,86 arc-45 127.2,84.31 127.2,49.79 arc-45 126.5,48.1 122.1,43.7 arc-45 120.41,43 117.09,43 arc45 115.4,42.3 113.7,40.6 arc45 113,38.91 113,31.94 arc45 113.7,30.25 2J.TOP
BUS13
  Bottom 0.3: HEADER-CH1_2.9 128.5,160.69 arc-45 127.8,159 123.72,154.92 arc-45 121.74,154.1 115.03,154.1 arc45 113.61,153.51 112.89,152.79 arc45 112.3,151.37 112.3,150.13 arc45 112.89,148.71 114.8,146.8 arc45 116.49,146.1 120.04,146.1 arc-45 122.02,145.28 125.68,141.62 arc-45 126.5,139.64 126.5,106.09 arc-45 125.8,104.4 121.7,100.3 arc-45 120.01,99.6 116.59,99.6 arc45 114.9,98.9 112.79,96.79 arc45 112.2,95.37 112.2,94.13 arc45 112.79,92.71 114.6,90.9 arc45 116.29,90.2 120.37,90.2 arc-45 121.79,89.61 125.91,85.49 arc-45 126.5,84.07 126.5,61.62 arc-45 125.8,59.93 2G.TOP
BUS15  (6 unrouted)
BUS16
  Bottom 0.3: HEADER-CH1_2.6 125.5,158.89 arc-45 124.8,157.2 123.1,155.5 arc-45 121.41,154.8 114.79,154.8 arc45 113.1,154.1 112.3,153.3 arc45 111.6,151.61 111.6,149.89 arc45 112.3,148.2 114.28,146.22 arc45 116.26,145.4 119.71,145.4 arc-45 121.4,144.7 125.1,141 arc-45 125.8,139.31 125.8,106.23 arc-45 125.21,104.81 121.29,100.89 arc-45 119.87,100.3 116.36,100.3 arc45 114.38,99.48 112.2,97.3 arc45 111.5,95.61 111.5,89.32 arc45 112.2,87.63 2E.TOP
BUS18
  Bottom 0.3: HEADER-CH1_2.4 123.5,158.03 arc-45 122.91,156.61 122.39,156.09 arc-45 120.97,155.5 114.56,155.5 arc45 112.58,154.68 111.72,153.82 arc45 110.9,151.84 110.9,149.66 arc45 111.72,147.68 113.76,145.64 arc45 116.03,144.7 119.37,144.7 arc-45 120.79,144.11 124.51,140.39 arc-45 125.1,138.97 125.1,116.1 arc-45 124.4,114.41 2C.TOP
BUS20
  Bottom 0.3: HEADER-CH1_2.2 121.5,159.59 arc-45 120.8,157.9 119.8,156.9 arc-45 118.11,156.2 114.33,156.2 arc45 112.06,155.26 111.14,154.34 arc45 110.2,152.08 110.2,149.43 arc45 111.14,147.16 118.88,139.42 2A.TOP
BUS21
  Bottom 0.3: HEADER-CH3-4.22 102.9,160.99 arc-45 102.2,159.3 95.27,152.37 arc45 94.8,151.24 94.8,150.36 arc45 95.27,149.23 97.11,147.39 arc45 98.53,146.8 102.08,146.8 arc-45 104.34,145.86 107.76,142.44 arc-45 108.7,140.18 108.7,105.46 arc-45 107.88,103.48 104.12,99.72 arc-45 102.14,98.9 98.73,98.9 arc45 97.31,98.31 95.17,96.17 arc45 94.7,95.04 94.7,94.56 arc45 95.17,93.43 97.11,91.49 arc45 98.53,90.9 102.51,90.9 arc-45 104.2,90.2 108.2,86.2 arc-45 108.9,84.51 108.9,49.59 arc-45 108.2,47.9 104,43.7 arc-45 102.31,43 98.69,43 arc45 97,42.3 95.4,40.7 arc45 94.7,39.01 94.7,31.95 arc45 95.4,30.26 3J.TOP
BUS23
  Bottom 0.3: HEADER-CH3-4.20 100.9,160.19 arc-45 100.2,158.5 94.69,152.99 arc45 94.1,151.57 94.1,150.03 arc45 94.69,148.61 96.5,146.8 arc45 98.19,146.1 101.74,146.1 arc-45 103.72,145.28 107.18,141.82 arc-45 108,139.84 108,105.69 arc-45 107.3,104 103.6,100.3 arc-45 101.91,99.6 98.49,99.6 arc45 96.8,98.9 94.59,96.69 arc45 94,95.27 94,94.23 arc45 94.59,92.81 96.5,90.9 arc45 98.19,90.2 102.27,90.2 arc-45 103.69,89.61 107.61,85.69 arc-45 108.2,84.27 108.2,61.61 arc-45 107.5,59.92 3G.TOP
BUS25  (6 unrouted)
BUS26
  Bottom 0.3: HEADER-CH3-4.17 97.9,158.39 arc-45 97.2,156.7 94.1,153.6 arc45 93.4,151.91 93.4,149.69 arc45 94.1,148 95.88,146.22 arc45 97.86,145.4 101.41,145.4 arc-45 103.1,144.7 106.6,141.2 arc-45 107.3,139.51 107.3,105.93 arc-45 106.71,104.51 103.09,100.89 arc-45 101.67,100.3 98.26,100.3 arc45 96.28,99.48 94,97.2 arc45 93.3,95.51 93.3,89.23 arc45 94,87.54 3E.TOP
BUS28
  Bottom 0.3: HEADER-CH3-4.15 95.9,157.59 arc-45 95.2,155.9 93.52,154.22 arc45 92.7,152.24 92.7,149.36 arc45 93.52,147.38 95.26,145.64 arc45 97.53,144.7 101.07,144.7 arc-45 102.49,144.11 106.01,140.59 arc-45 106.6,139.17 106.6,115.89 arc-45 105.9,114.2 3C.TOP
BUS30
  Bottom 0.3: HEADER-CH3-4.13 93.9,156.79 arc-45 93.2,155.1 92.94,154.84 arc45 92,152.58 92,149.03 arc45 92.94,146.76 100.59,139.11 3A.TOP
BUS31
  Bottom 0.3: HEADER-CH3-4.11 91.9,159.59 arc-45 91.2,157.9 87.4,154.1 arc-45 85.71,153.4 78.56,153.4 arc45 77.43,152.93 76.87,152.37 arc45 76.4,151.24 76.4,150.26 arc45 76.87,149.13 78.61,147.39 arc45 80.03,146.8 83.78,146.8 arc-45 86.04,145.86 89.66,142.24 arc-45 90.6,139.97 90.6,105.76 arc-45 89.78,103.78 85.72,99.72 arc-45 83.74,98.9 80.63,98.9 arc45 79.21,98.31 76.97,96.07 arc45 76.5,94.94 76.5,94.76 arc45 76.97,93.63 79.11,91.49 arc45 80.53,90.9 84.21,90.9 arc-45 85.9,90.2 89.9,86.2 arc-45 90.6,84.51 90.6,49.69 arc-45 89.9,48 85.6,43.7 arc-45 83.91,43 80.59,43 arc45 78.9,42.3 77.1,40.5 arc45 76.4,38.81 76.4,31.96 arc45 77.1,30.27 4J.TOP
BUS33
  Bottom 0.3: HEADER-CH3-4.9 89.9,158.69 arc-45 89.2,157 86.89,154.69 arc-45 85.47,154.1 78.23,154.1 arc45 76.81,153.51 76.29,152.99 arc45 75.7,151.57 75.7,149.93 arc45 76.29,148.51 78,146.8 arc45 79.69,146.1 83.44,146.1 arc-45 85.42,145.28 89.08,141.62 arc-45 89.9,139.64 89.9,106.09 arc-45 89.2,104.4 85.1,100.3 arc-45 83.41,99.6 80.39,99.6 arc45 78.7,98.9 76.39,96.59 arc45 75.8,95.17 75.8,94.43 arc45 76.39,93.01 78.5,90.9 arc45 80.19,90.2 83.87,90.2 arc-45 85.29,89.61 89.31,85.59 arc-45 89.9,84.17 89.9,61.6 arc-45 89.2,59.91 4G.TOP
BUS35  (6 unrouted)
BUS36
  Bottom 0.3: HEADER-CH3-4.6 86.9,163.7 86.8,163.6 86.8,157.99 arc-45 86.1,156.3 85.3,155.5 arc-45 83.61,154.8 77.89,154.8 arc45 76.2,154.1 75.7,153.6 arc45 75,151.91 75,149.59 arc45 75.7,147.9 77.38,146.22 arc45 79.36,145.4 83.11,145.4 arc-45 84.8,144.7 88.5,141 arc-45 89.2,139.31 89.2,106.43 arc-45 88.61,105.01 84.49,100.89 arc-45 83.07,100.3 80.16,100.3 arc45 78.18,99.48 75.8,97.1 arc45 75.1,95.41 75.1,89.14 arc45 75.8,87.45 4E.TOP
BUS38
  Bottom 0.3: HEADER-CH3-4.4 84.9,158.89 arc-45 84.2,157.2 83.2,156.2 arc-45 81.51,155.5 77.56,155.5 arc45 75.58,154.68 75.12,154.22 arc45 74.3,152.24 74.3,149.26 arc45 75.12,147.28 76.76,145.64 arc45 79.03,144.7 82.77,144.7 arc-45 84.19,144.11 87.91,140.39 arc-45 88.5,138.97 88.5,116.08 arc-45 87.8,114.39 4C.TOP
BUS40
  Bottom 0.3: HEADER-CH3-4.2 82.9,160.09 arc-45 82.2,158.4 80.7,156.9 arc-45 79.01,156.2 77.22,156.2 arc45 74.96,155.26 74.54,154.84 arc45 73.6,152.58 73.6,148.93 arc45 74.54,146.66 82.3,138.9 4A.TOP
BUS41
  Bottom 0.3: HEADER-CH5-6.22 64.1,158.93 arc-45 63.16,156.66 58.57,152.07 arc45 58.1,150.94 58.1,150.36 arc45 58.57,149.23 60.41,147.39 arc45 61.83,146.8 65.58,146.8 arc-45 67.84,145.86 71.36,142.34 arc-45 72.3,140.08 72.3,105.56 arc-45 71.48,103.58 67.62,99.72 arc-45 65.64,98.9 62.23,98.9 arc45 60.81,98.31 58.57,96.07 arc45 58.1,94.94 58.1,94.86 arc45 58.57,93.73 60.81,91.49 arc45 62.23,90.9 65.81,90.9 arc-45 67.5,90.2 71.6,86.1 arc-45 72.3,84.41 72.3,49.79 arc-45 71.6,48.1 67.2,43.7 arc-45 65.51,43 62.49,43 arc45 60.8,42.3 58.9,40.4 arc45 58.2,38.71 58.2,31.87 arc45 58.9,30.18 5J.TOP
BUS43
  Bottom 0.3: HEADER-CH5-6.20 62.1,158.12 arc-45 61.16,155.86 57.89,152.59 arc45 57.3,151.17 57.3,150.23 arc45 57.89,148.81 59.9,146.8 arc45 61.59,146.1 65.24,146.1 arc-45 67.22,145.28 70.78,141.72 arc-45 71.6,139.74 71.6,105.79 arc-45 70.9,104.1 67.1,100.3 arc-45 65.41,99.6 61.99,99.6 arc45 60.3,98.9 57.89,96.49 arc45 57.3,95.07 57.3,94.83 arc45 57.89,93.41 60.4,90.9 arc45 62.09,90.2 65.47,90.2 arc-45 66.89,89.61 71.01,85.49 arc-45 71.6,84.07 71.6,61.59 arc-45 70.9,59.9 5G.TOP
BUS45  (6 unrouted)
BUS46
  Bottom 0.3: HEADER-CH5-6.17 59.1,155.99 arc-45 58.4,154.3 57.3,153.2 arc45 56.6,151.51 56.6,149.99 arc45 57.3,148.3 59.38,146.22 arc45 61.36,145.4 64.91,145.4 arc-45 66.6,144.7 70.2,141.1 arc-45 70.9,139.41 70.9,106.03 arc-45 70.31,104.61 66.59,100.89 arc-45 65.17,100.3 61.59,100.3 arc45 59.9,99.6 57.3,97 arc45 56.6,95.31 56.6,89.35 arc45 57.3,87.66 5E.TOP
BUS48
  Bottom 0.3: HEADER-CH5-6.15 57.1,162.23 arc45 57.69,160.81 57.81,160.69 arc-45 58.4,159.27 58.4,156.23 arc-45 57.81,154.81 56.72,153.72 arc45 55.9,151.74 55.9,149.76 arc45 56.72,147.78 58.86,145.64 arc45 61.12,144.7 64.57,144.7 arc-45 65.99,144.11 69.61,140.49 arc-45 70.2,139.07 70.2,116.07 arc-45 69.5,114.38 5C.TOP
BUS50
  Bottom 0.3: HEADER-CH5-6.13 55.1,149.53 arc45 56.04,147.26 63.7,139.6 63.7,137.58 arc45 5A.TOP
BUS51
  Bottom 0.3: HEADER-CH5-6.11 53.1,159.39 arc-45 52.4,157.7 49.04,154.34 arc-45 46.77,153.4 42.63,153.4 arc45 41.21,152.81 40.37,151.97 arc45 39.9,150.84 39.9,150.66 arc45 40.37,149.53 42.51,147.39 arc45 43.93,146.8 46.98,146.8 arc-45 49.24,145.86 52.96,142.14 arc-45 53.9,139.88 53.9,105.96 arc-45 53.08,103.98 48.82,99.72 arc-45 46.84,98.9 44.03,98.9 arc45 42.61,98.31 40.37,96.07 arc45 39.9,94.94 39.9,94.66 arc45 40.37,93.53 43,90.9 47.51,90.9 arc-45 49.2,90.2 54,85.4 54,49.59 arc-45 53.3,47.9 49.2,43.8 arc-45 47.51,43.1 43.89,43.1 arc45 42.2,42.4 40.5,40.7 arc45 39.8,39.01 39.8,31.98 arc45 40.5,30.29 6J.TOP
BUS53
  Bottom 0.3: HEADER-CH5-6.9 51.1,158.59 arc-45 50.4,156.9 48.3,154.8 arc-45 46.61,154.1 42.39,154.1 arc45 40.7,153.4 39.79,152.49 arc45 39.2,151.07 39.2,150.33 arc45 39.79,148.91 41.9,146.8 arc45 43.59,146.1 46.74,146.1 arc-45 48.72,145.28 52.38,141.62 arc-45 53.2,139.64 53.2,106.19 arc-45 52.5,104.5 48.3,100.3 arc-45 46.61,99.6 43.79,99.6 arc45 42.1,98.9 39.2,96 39.2,93.6 42.6,90.2 48.1,90.2 52.71,85.59 arc-45 53.3,84.17 53.3,61.58 arc-45 52.6,59.89 6G.TOP
BUS55  (6 unrouted)
BUS56
  Bottom 0.3: HEADER-CH5-6.6 48.1,157.79 arc-45 47.4,156.1 46.8,155.5 arc-45 45.11,154.8 41.99,154.8 arc45 40.3,154.1 39.2,153 arc45 38.5,151.31 38.5,149.99 arc45 39.2,148.3 41.28,146.22 arc45 43.26,145.4 46.51,145.4 arc-45 48.2,144.7 51.8,141.1 arc-45 52.5,139.41 52.5,106.53 arc-45 51.91,105.11 47.69,100.89 arc-45 46.27,100.3 43.56,100.3 arc45 41.58,99.48 38.5,96.4 38.5,89.16 arc45 39.2,87.47 6E.TOP
BUS58
  Bottom 0.3: HEADER-CH5-6.4 46.1,158.29 arc-45 45.4,156.6 45,156.2 arc-45 43.31,155.5 41.76,155.5 arc45 39.78,154.68 38.62,153.52 arc45 37.8,151.54 37.8,149.66 arc45 38.62,147.68 40.66,145.64 arc45 42.92,144.7 46.27,144.7 arc-45 47.69,144.11 51.21,140.59 arc-45 51.8,139.17 51.8,115.96 arc-45 51.1,114.27 6C.TOP
BUS60
  Bottom 0.3: HEADER-CH5-6.2 44.1,158.89 arc-45 43.4,157.2 43.02,156.82 arc-45 41.52,156.2 arc45 39.26,155.26 38.04,154.04 arc45 37.1,151.78 37.1,146.78 arc45 38.04,144.51 6A.TOP
BUS61
  Bottom 0.3: HEADER-CH7_8.22 25.4,156.36 arc-45 24.58,154.38 22.19,151.99 arc45 21.6,150.57 arc45 21.93,149.77 24.31,147.39 arc45 25.73,146.8 28.57,146.8 arc-45 30.84,145.86 34.66,142.04 arc-45 35.6,139.78 35.6,105.76 arc-45 34.78,103.78 30.72,99.72 arc-45 28.74,98.9 25.63,98.9 arc45 24.21,98.31 22.07,96.17 arc45 21.6,95.04 21.6,94.68 arc46 22.09,93.53 24.22,91.46 arc44 25.61,90.9 28.91,90.9 arc-45 30.6,90.2 33.3,87.5 arc-45 34,85.81 34,48.36 arc-45 33.18,46.38 30.72,43.92 arc-45 28.74,43.1 26.16,43.1 arc45 24.18,42.28 22.32,40.42 arc45 21.5,38.44 21.5,32.16 arc45 22.32,30.18 7J.TOP
BUS63
  Bottom 0.3: HEADER-CH7_8.20 23.4,155.39 arc-45 22.7,153.7 21.6,152.6 arc45 20.9,150.91 20.9,150.69 arc45 21.6,149 23.8,146.8 arc45 25.49,146.1 28.34,146.1 arc-45 30.32,145.28 34.08,141.52 arc-45 34.9,139.54 34.9,105.89 arc-45 34.2,104.2 30.3,100.3 arc-45 28.61,99.6 25.39,99.6 arc45 23.7,98.9 21.49,96.69 arc45 20.9,95.27 20.9,94.43 arc45 21.49,93.01 23.6,90.9 arc45 25.29,90.2 28.67,90.2 arc-45 30.09,89.61 32.71,86.99 arc-45 33.3,85.57 33.3,60.04 arc-45 32.48,58.06 7G.TOP
BUS65  (6 unrouted)
BUS66
  Bottom 0.3: 7E.TOP 20.9,87.48 arc-45 20.2,89.17 20.2,95.51 arc-45 20.9,97.2 23.18,99.48 arc-45 25.16,100.3 28.37,100.3 arc45 29.79,100.89 33.61,104.71 arc45 34.2,106.13 34.2,139.31 arc45 33.5,141 29.8,144.7 arc45 28.11,145.4 25.26,145.4 arc-45 23.28,146.22 21.02,148.48 arc-45 20.2,150.46 20.2,151.04 arc-45 21.02,153.22 21.6,153.8 arc45 22.3,155.69 22.3,157.54 arc45 21.48,159.52 21.2,159.8 arc-45 20.4,161.73 HEADER-CH7_8.17
BUS68
  Bottom 0.3: HEADER-CH7_8.15 18.4,151.43 arc45 19.34,149.16 22.86,145.64 arc45 25.12,144.7 27.87,144.7 arc-45 29.29,144.11 32.91,140.49 arc-45 33.5,139.07 33.5,115.95 arc-45 32.8,114.26 7C.TOP
BUS70
  Bottom 0.3: HEADER-CH7_8.13 16.4,152.39 arc45 17.45,149.85 27.43,139.87 7A.TOP
BUS71
  Bottom 0.3: HEADER-CH7_8.11 14.4,159.86 arc-45 13.58,157.88 8.92,153.22 arc-45 6.94,152.4 5.16,152.4 arc45 4.03,151.93 3.87,151.77 arc45 3.4,150.64 arc45 3.71,149.89 6.21,147.39 arc45 7.63,146.8 10.28,146.8 arc-45 12.54,145.86 16.36,142.04 arc-45 17.3,139.78 17.3,105.86 arc-45 16.48,103.88 12.32,99.72 arc-45 10.34,98.9 7.13,98.9 arc45 5.71,98.31 3.77,96.37 arc45 3.3,95.24 3.3,94.46 arc45 3.77,93.33 5.61,91.49 arc45 7.03,90.9 9.31,90.9 arc-45 11,90.2 15.2,86 arc-45 15.9,84.31 15.9,48.56 arc-45 15.08,46.58 12.42,43.92 arc-45 10.44,43.1 7.46,43.1 arc45 5.48,42.28 4.02,40.82 arc45 3.2,38.84 3.2,32.17 arc45 4.02,30.19 8J.TOP
BUS73
  Bottom 0.3: HEADER-CH7_8.9 12.4,158.96 arc-45 11.58,156.98 8.4,153.8 arc-45 6.71,153.1 4.93,153.1 arc45 3.51,152.51 3.29,152.29 arc45 2.7,150.87 2.7,150.73 arc45 3.29,149.31 5.8,146.8 arc45 7.49,146.1 10.14,146.1 arc-45 12.12,145.28 15.78,141.62 arc-45 16.6,139.64 16.6,105.99 arc-45 15.9,104.3 11.9,100.3 arc-45 10.21,99.6 6.89,99.6 arc45 5.2,98.9 3.19,96.89 arc45 2.6,95.47 2.6,94.23 arc45 3.19,92.81 5.1,90.9 arc45 6.79,90.2 9.07,90.2 arc-45 10.49,89.61 14.61,85.49 arc-45 15.2,84.07 15.2,60.23 arc-45 14.38,58.25 8G.TOP
BUS75  (6 unrouted)
BUS76
  Bottom 0.3: HEADER-CH7_8.6 9.4,156.73 arc-45 8.81,155.31 7.89,154.39 arc-45 6.47,153.8 4.69,153.8 arc45 3,153.1 2.7,152.8 arc45 2,151.11 2,150.59 arc45 2.7,148.9 5.38,146.22 arc45 7.36,145.4 10.01,145.4 arc-45 11.7,144.7 15.2,141.2 arc-45 15.9,139.51 15.9,106.13 arc-45 15.31,104.71 11.49,100.89 arc-45 10.07,100.3 6.66,100.3 arc45 4.68,99.48 2.72,97.52 arc45 1.9,95.54 1.9,89.35 arc45 2.72,87.37 8E.TOP
BUS78
  Bottom 0.3: HEADER-CH7_8.4 7.4,162.26 arc-45 6.58,160.28 2,155.7 arc45 1.3,154.01 1.3,150.46 arc45 2.12,148.48 4.96,145.64 arc45 7.22,144.7 9.87,144.7 arc-45 11.29,144.11 14.61,140.79 arc-45 15.2,139.37 15.2,116.28 arc-45 14.26,114.01 8C.TOP
BUS80
  Bottom 0.3: HEADER-CH7_8.2 5.4,161.36 arc-45 4.58,159.38 1.42,156.22 arc45 0.6,154.24 0.6,146.53 arc45 1.42,144.55 8A.TOP